# EasyEDA schematic FlexLight.json
TITLE: LED PCB Schematics; REV: 1.0; Date: 2021-08-08; Sheet: 1/1; Company: FlexLight OpenSource Project
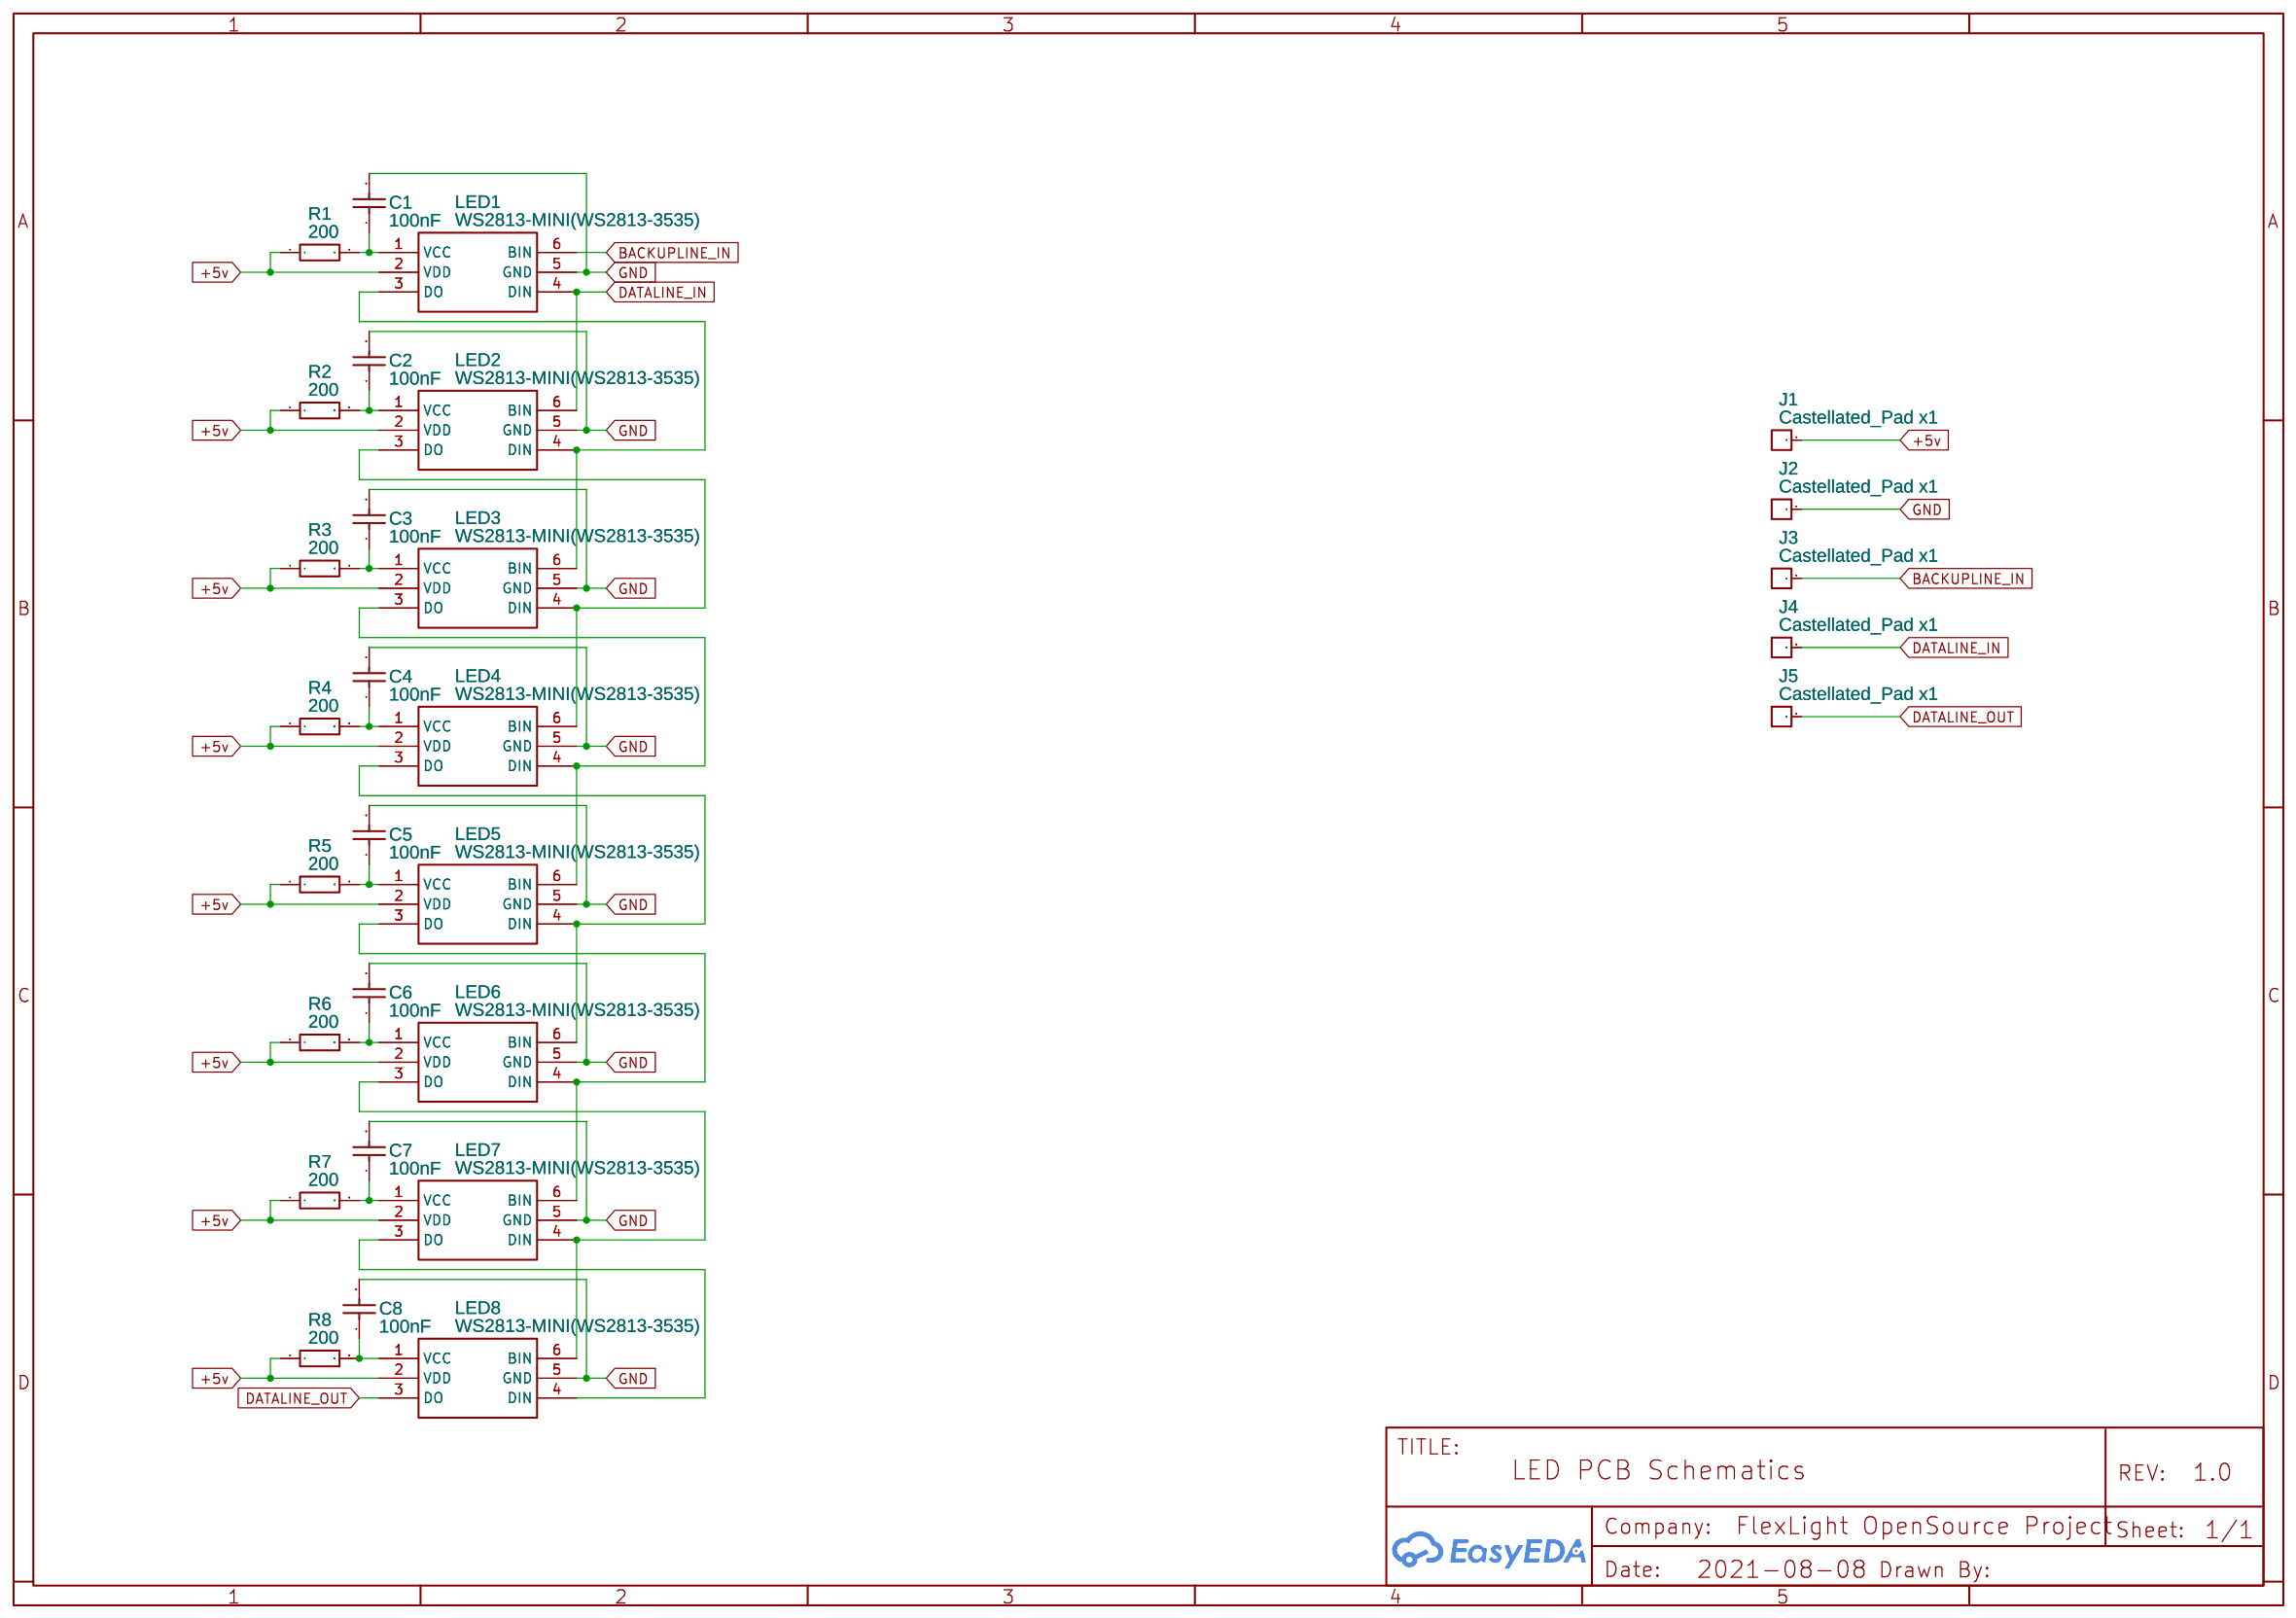
[diagram p0: schematic sheet]

## Parts
C1  100nF  [C0402_NEW]
C2  100nF  [C0402_NEW]
C3  100nF  [C0402_NEW]
C4  100nF  [C0402_NEW]
C5  100nF  [C0402_NEW]
C6  100nF  [C0402_NEW]
C7  100nF  [C0402_NEW]
C8  100nF  [C0402_NEW]
J1  Castellated_Pad x1  [CASTELLATED_PAD_2]
J2  Castellated_Pad x1  [CASTELLATED_PAD_2]
J3  Castellated_Pad x1  [CASTELLATED_PAD_2]
J4  Castellated_Pad x1  [CASTELLATED_PAD_2]
J5  Castellated_Pad x1  [CASTELLATED_PAD_2]
LED1  WS2813-MINI(WS2813-3535)  [LED-SMD_L3.5-W3.5-P1.10-BR]
LED2  WS2813-MINI(WS2813-3535)  [LED-SMD_L3.5-W3.5-P1.10-BR]
LED3  WS2813-MINI(WS2813-3535)  [LED-SMD_L3.5-W3.5-P1.10-BR]
LED4  WS2813-MINI(WS2813-3535)  [LED-SMD_L3.5-W3.5-P1.10-BR]
LED5  WS2813-MINI(WS2813-3535)  [LED-SMD_L3.5-W3.5-P1.10-BR]
LED6  WS2813-MINI(WS2813-3535)  [LED-SMD_L3.5-W3.5-P1.10-BR]
LED7  WS2813-MINI(WS2813-3535)  [LED-SMD_L3.5-W3.5-P1.10-BR]
LED8  WS2813-MINI(WS2813-3535)  [LED-SMD_L3.5-W3.5-P1.10-BR]
R1  200  [R0402]
R2  200  [R0402]
R3  200  [R0402]
R4  200  [R0402]
R5  200  [R0402]
R6  200  [R0402]
R7  200  [R0402]
R8  200  [R0402]

## Library data of the parts
C1-C8 = CL05B104KO5NNNC: Supplier: LCSC; Manufacturer: SAMSUNG; Supplier Part: C1525; JLCPCB Part Class: Basic Part
J1-J5 = Castellated_Pad x1: Contributor: Bhoopal Reddy
LED1-LED8 = WS2813-MINI(WS2813-3535): Supplier: LCSC; Supplier Part: C189639; Manufacturer: Worldsemi; Manufacturer Part: WS2813-Mini(WS2813-3535); Contributor: LCSC; JLCPCB Part Class: Extended Part
R1-R8 = 0402WGF2000TCE: Supplier: LCSC; Manufacturer: UniOhm; Supplier Part: C25087; JLCPCB Part Class: Basic Part

## Nets
+5v: J1.1(P) LED1.2(VDD) LED2.2(VDD) LED3.2(VDD) LED4.2(VDD) LED5.2(VDD) LED6.2(VDD) LED7.2(VDD) LED8.2(VDD) R1.1 R2.1 R3.1 R4.1 R5.1 R6.1 R7.1 R8.1
GND: C1.2 C2.2 C3.2 C4.2 C5.2 C6.2 C7.2 C8.2 J2.1(P) LED1.5(GND) LED2.5(GND) LED3.5(GND) LED4.5(GND) LED5.5(GND) LED6.5(GND) LED7.5(GND) LED8.5(GND)
BACKUPLINE_IN: J3.1(P) LED1.6(BIN)
DATALINE_IN: J4.1(P) LED1.4(DIN) LED2.6(BIN)
DATALINE_OUT: J5.1(P) LED8.3(DO)
Net-(C1-1): C1.1 LED1.1(VCC) R1.2
Net-(C2-1): C2.1 LED2.1(VCC) R2.2
Net-(C3-1): C3.1 LED3.1(VCC) R3.2
Net-(C4-1): C4.1 LED4.1(VCC) R4.2
Net-(C5-1): C5.1 LED5.1(VCC) R5.2
Net-(C6-1): C6.1 LED6.1(VCC) R6.2
Net-(C7-1): C7.1 LED7.1(VCC) R7.2
Net-(C8-1): C8.1 LED8.1(VCC) R8.2
Net-(LED1-3): LED1.3(DO) LED2.4(DIN) LED3.6(BIN)
Net-(LED2-3): LED2.3(DO) LED3.4(DIN) LED4.6(BIN)
Net-(LED3-3): LED3.3(DO) LED4.4(DIN) LED5.6(BIN)
Net-(LED4-3): LED4.3(DO) LED5.4(DIN) LED6.6(BIN)
Net-(LED5-3): LED5.3(DO) LED6.4(DIN) LED7.6(BIN)
Net-(LED6-3): LED6.3(DO) LED7.4(DIN) LED8.6(BIN)
Net-(LED7-3): LED7.3(DO) LED8.4(DIN)
